# EAGLE schematic BNSK-Rambo-Converters-Device (EAGLE 9.6.2)
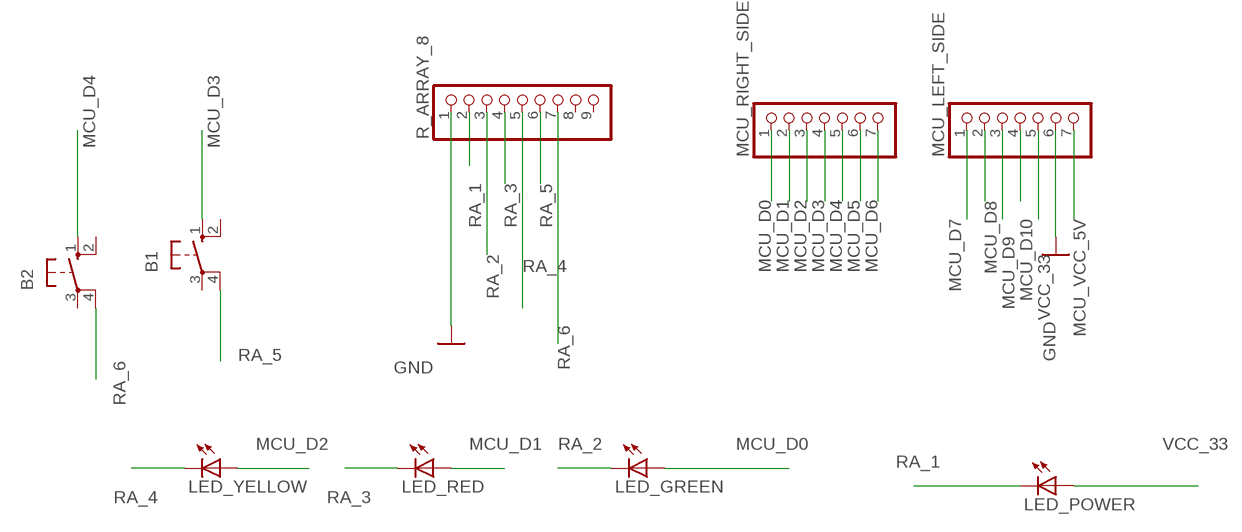
[diagram p0: schematic, sheet 1]

## Parts
B1  10-XX  [B3F-10XX]
B2  10-XX  [B3F-10XX]
LED_GREEN  LEDSMT1206  [1206]
LED_POWER  LEDSMT1206  [1206]
LED_RED  LEDSMT1206  [1206]
LED_YELLOW  LEDSMT1206  [1206]
MCU_LEFT_SIDE  PINHD-1X7  [1X07]
MCU_RIGHT_SIDE  PINHD-1X7  [1X07]
R_ARRAY_8  PINHD-1X9  [1X09-BIG]

## Nets
GND: MCU_LEFT_SIDE.6 R_ARRAY_8.1
MCU_D0: LED_GREEN.A MCU_RIGHT_SIDE.1
MCU_D1: LED_RED.A MCU_RIGHT_SIDE.2
MCU_D2: LED_YELLOW.A MCU_RIGHT_SIDE.3
MCU_D3: B1.1(S) MCU_RIGHT_SIDE.4
MCU_D4: B2.1(S) MCU_RIGHT_SIDE.5
MCU_D5: MCU_RIGHT_SIDE.6
MCU_D6: MCU_RIGHT_SIDE.7
MCU_D7: MCU_LEFT_SIDE.1
MCU_D8: MCU_LEFT_SIDE.2
MCU_D9: MCU_LEFT_SIDE.3
MCU_D10: MCU_LEFT_SIDE.4
MCU_VCC_5V: MCU_LEFT_SIDE.7
RA_1: LED_POWER.C R_ARRAY_8.2
RA_2: LED_GREEN.C R_ARRAY_8.3
RA_3: LED_RED.C R_ARRAY_8.4
RA_4: LED_YELLOW.C R_ARRAY_8.5
RA_5: B1.4(P1) R_ARRAY_8.6
RA_6: B2.4(P1) R_ARRAY_8.7
VCC_33: LED_POWER.A MCU_LEFT_SIDE.5
Unconnected: B1.2(S1) B1.3(P) B2.2(S1) B2.3(P) R_ARRAY_8.8 R_ARRAY_8.9

## Library data of the parts
B1 B2 = switch-omron:10-XX: OMRON SWITCH; MPN: B3F-1000; OC_FARNELL: 176432; OC_NEWARK: 36M3542
LED_GREEN LED_POWER LED_RED LED_YELLOW = adafruit:LED: LED OSRAM: - CHIPLED LG R971, LG N971, LY N971, LG Q971, LY Q971, LO R971, LY R971 LH N974, LH R974 LS Q976, LO Q976, LY Q976 LO Q996 - Hyper CHIPLED LW Q18S LB Q993, LB Q99A, LB R99A - SideLED LS A670, LO A670, LY A670, LG A670, LP A670 LB A673, LV A673, LT A673, LW A673 LH A674 LY A675 LS A676, LA A676, LO A676, LY A676, LW A676 LS A679, LY A679, LG A679 - Hyper Micro SIDELED® LS Y876, LA Y876, LO Y876, LY Y876 LT Y87S - SmartLED LW L88C, LW L88S LB L89C, LB L89S, LG L890 LS L89K, LO L89K, LY L89K LS L896, LA L896, LO L896, LY L896 - TOPLED LS T670, LO T670, LY T670, LG T670, LP T670 LSG T670, LSP T670, LSY T670, LOP T670, LYG T670 LG T671, LOG T671, LSG T671 LB T673, LV T673, LT T673, LW T673 LH T674 LS T676, LA T676, LO T676, LY T676, LB T676, LH T676, LSB T676, LW T676 LB T67C, LV T67C, LT T67C, LS T67K, LO T67K, LY T67K, LW E67C LS E67B, LA E67B, LO E67B, LY E67B, LB E67C, LV E67C, LT E67C LW T67C LS T679, LY T679, LG T679 LS T770, LO T770, LY T770, LG T770, LP T770 LB T773, LV T773, LT T773, LW T773 LH T774 LS E675, LA E675, LY E675, LS T675 LS T776, LA T776, LO T776, LY T776, LB T776 LHGB T686 LT T68C, LB T68C - Hyper Mini TOPLED® LB M676 - Mini TOPLED Santana® LG M470 LS M47K, LO M47K, LY M47K Source: http://www.osram.convergy.de/
MCU_LEFT_SIDE MCU_RIGHT_SIDE = pinhead:PINHD-1X7: PIN HEADER
R_ARRAY_8 = adafruit:PINHD-1X9: Pin header 1x10 0.1" spacing With round pins